# Altium schematic sheet 电子脚铐本体电池转接板.SchDoc
size A4
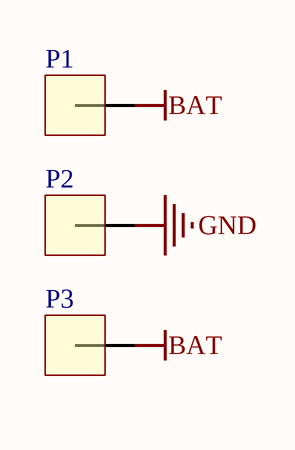
[diagram p0: 电子脚铐本体电池转接板.SchDoc]

## Parts
P1  (no value)  [Pad3.2*3.2*7.1-SM]
P2  (no value)  [Pad3.2*3.2*7.1-SM]
P3  (no value)  [Pad3.2*3.2*7.1-SM]

## Nets
BAT: P1.1 P3.1
GND: P2.1

## Notes on the sheet
- 文件名:
- 审核:
- 制图人:
- 孟浩
- 校对:
- 图号:
- 批准:
- 日期:

## Library data of the parts
P1-P3 = Pad-1.5x1-1